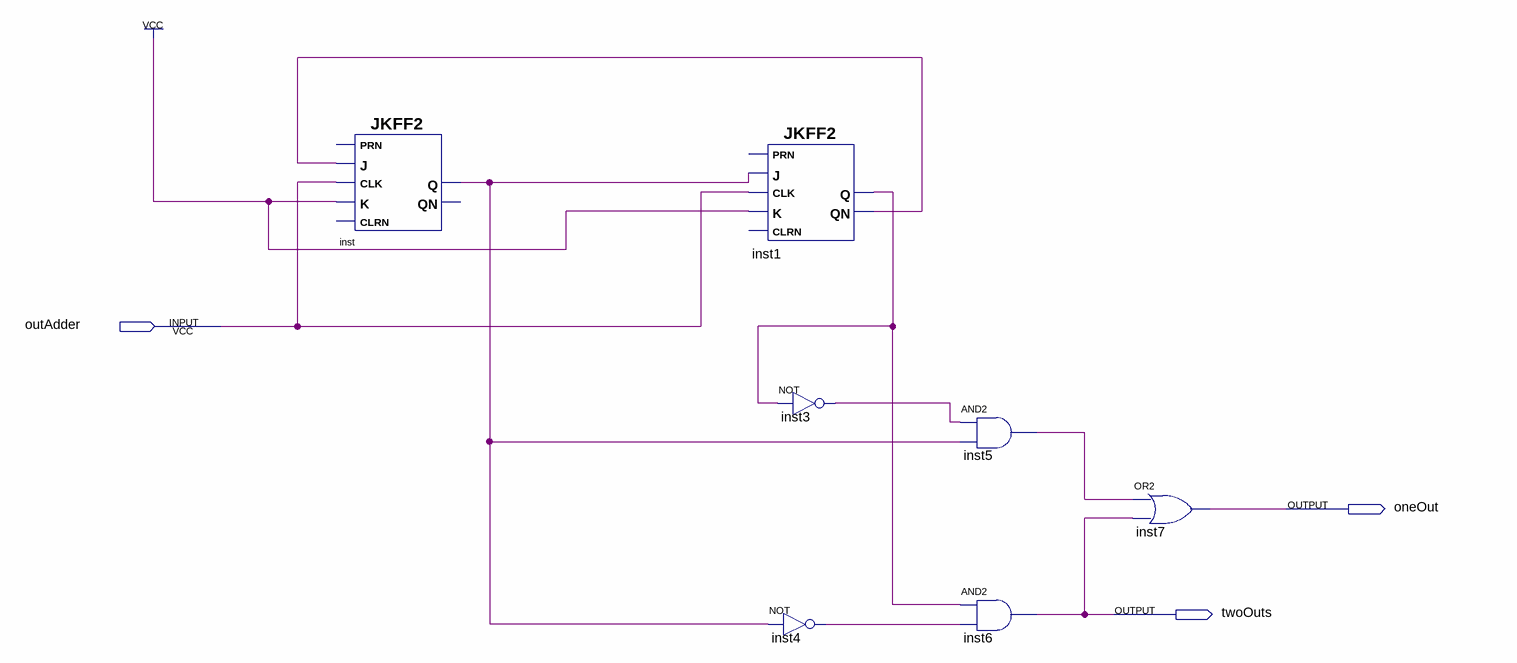
[diagram p0: schematic sheet]
// Quartus schematic outLEDs.bdf as structural Verilog: 7 symbols, 3 pins
module outLEDs (
  input  outAdder,
  output oneOut,
  output twoOuts
);

  wire inst1_q, inst1_qn, inst3_out, inst4_out, inst5_out, inst_q;

  JKFF2 inst (.K(1'b1), .CLK(outAdder), .J(inst1_qn), .Q(inst_q));  // open: CLRN, PRN, QN
  JKFF2 inst1 (.K(1'b1), .CLK(outAdder), .J(inst_q), .QN(inst1_qn), .Q(inst1_q));  // open: CLRN, PRN
  not inst4 (inst4_out, inst_q);
  not inst3 (inst3_out, inst1_q);
  and inst5 (inst5_out, inst3_out, inst_q);
  and inst6 (twoOuts, inst1_q, inst4_out);
  or inst7 (oneOut, inst5_out, twoOuts);
endmodule
